# EasyEDA schematic SCH_lonsonho-switch-1.json
TITLE: Sheet_1; REV: 1.0; Date: 2024-03-23; Sheet: 1/1; Drawn By: Alex Cherkaev; Company: Your Company
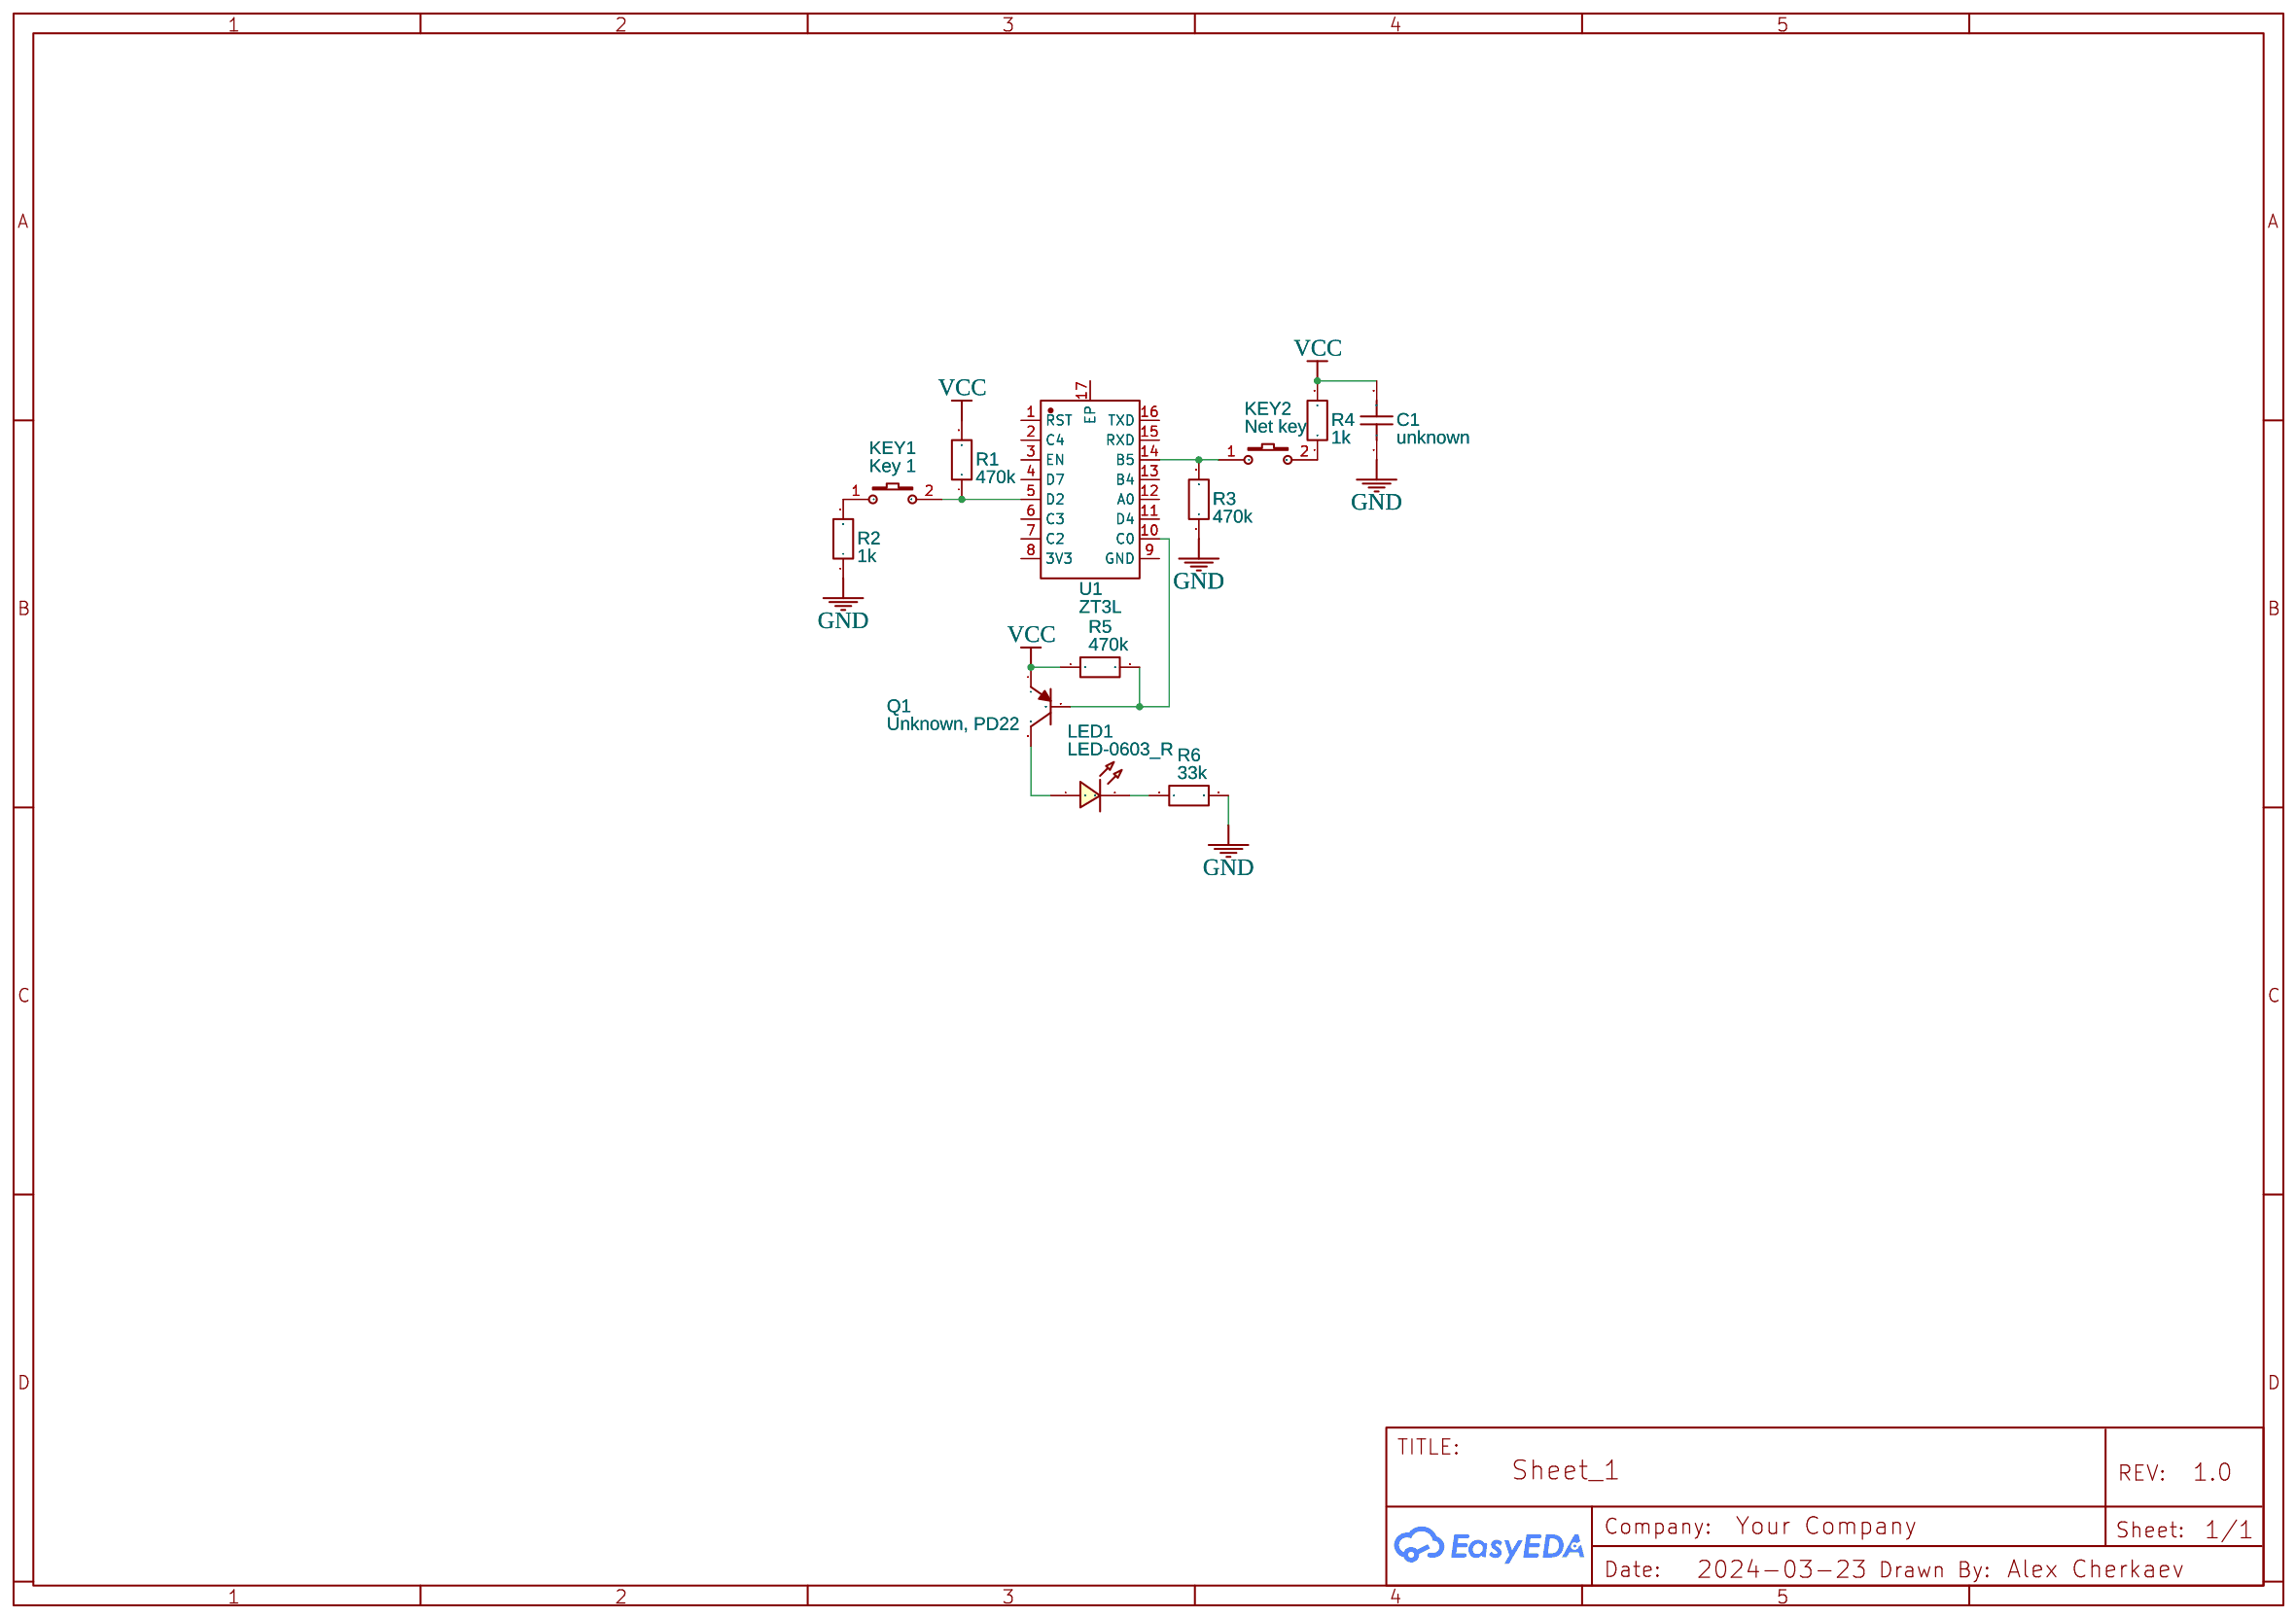
[diagram p0: schematic sheet]

## Parts
C1  unknown  [C0603]
KEY1  Key 1  [KEY-SMD_2P-L6.2-W3.6-LS8.0]
KEY2  Net key  [KEY-SMD_2P-L6.2-W3.6-LS8.0]
LED1  LED-0603_R  [LED0603_RED]
Q1  Unknown, PD22  [SOT-23-3_L2.9-W1.6-P1.90-LS2.8-TR-CW]
R1  470k  [R0603]
R2  1k  [R0603]
R3  470k  [R0603]
R4  1k  [R0603]
R5  470k  [R0603]
R6  33k  [R0603]
U1  ZT3L  [WIRELM-SMD_16P-L24.0-W16.0-P2.00]

## Library data of the parts
C1 = C_0603_US: Contributor: LCEDA_Lib
KEY1 KEY2 = K2-3.6×6.1_SMD: Supplier Part: C118141; Supplier: LCSC; Manufacturer Part: K2-1107ST-A4SW-06; Contributor: LCEDA_Lib; 制造商: 韩国韩荣
LED1 = LED-0603_R: Manufacturer: EVERLIGHT(台湾亿光); Manufacturer Part: 19-217/R6C-AL1M2VY/3T; Supplier Part: C72044; Supplier: LCSC; Contributor: LCEDA_01
Q1 = 2N3906(SOT-23): Supplier: LCSC; Manufacturer: KEC; Manufacturer Part: 2N3906S-RTK/PS; Contributor: LCEDA_Lib; Supplier Part: C147294
R1-R6 = R_0603_EU: Contributor: LCEDA_Lib
U1 = ZT3L: Contributor: lcsc; Supplier: LCSC; Supplier Part: C2897596; Manufacturer: YTL(亚特联); JLCPCB Part Class: Extended Part

## Nets
GND: C1.1 R2.1 R3.1 R6.2
VCC: C1.2 Q1.1(E) R1.2 R4.2 R5.1
Net-(KEY1-1): KEY1.1 R2.2
Net-(KEY1-2): KEY1.2 R1.1 U1.5(D2)
Net-(KEY2-1): KEY2.1 R3.2 U1.14(B5)
Net-(KEY2-2): KEY2.2 R4.1
Net-(LED1-1): LED1.1 Q1.3(C)
Net-(LED1-2): LED1.2 R6.1
Net-(Q1-2): Q1.2(B) R5.2 U1.10(C0)

Not connected (* = marked no-connect by the designer): U1 1(RST) 2(C4) 3(EN) 4(D7) 6(C3) 7(C2) 8(3V3) 9(GND) 11(D4) 12(A0) 13(B4) 15(RXD) 16(TXD) 17(EP)
